# Altium schematic sheet IPG-V1_rev0.24.SchDoc (part 2 of 3)
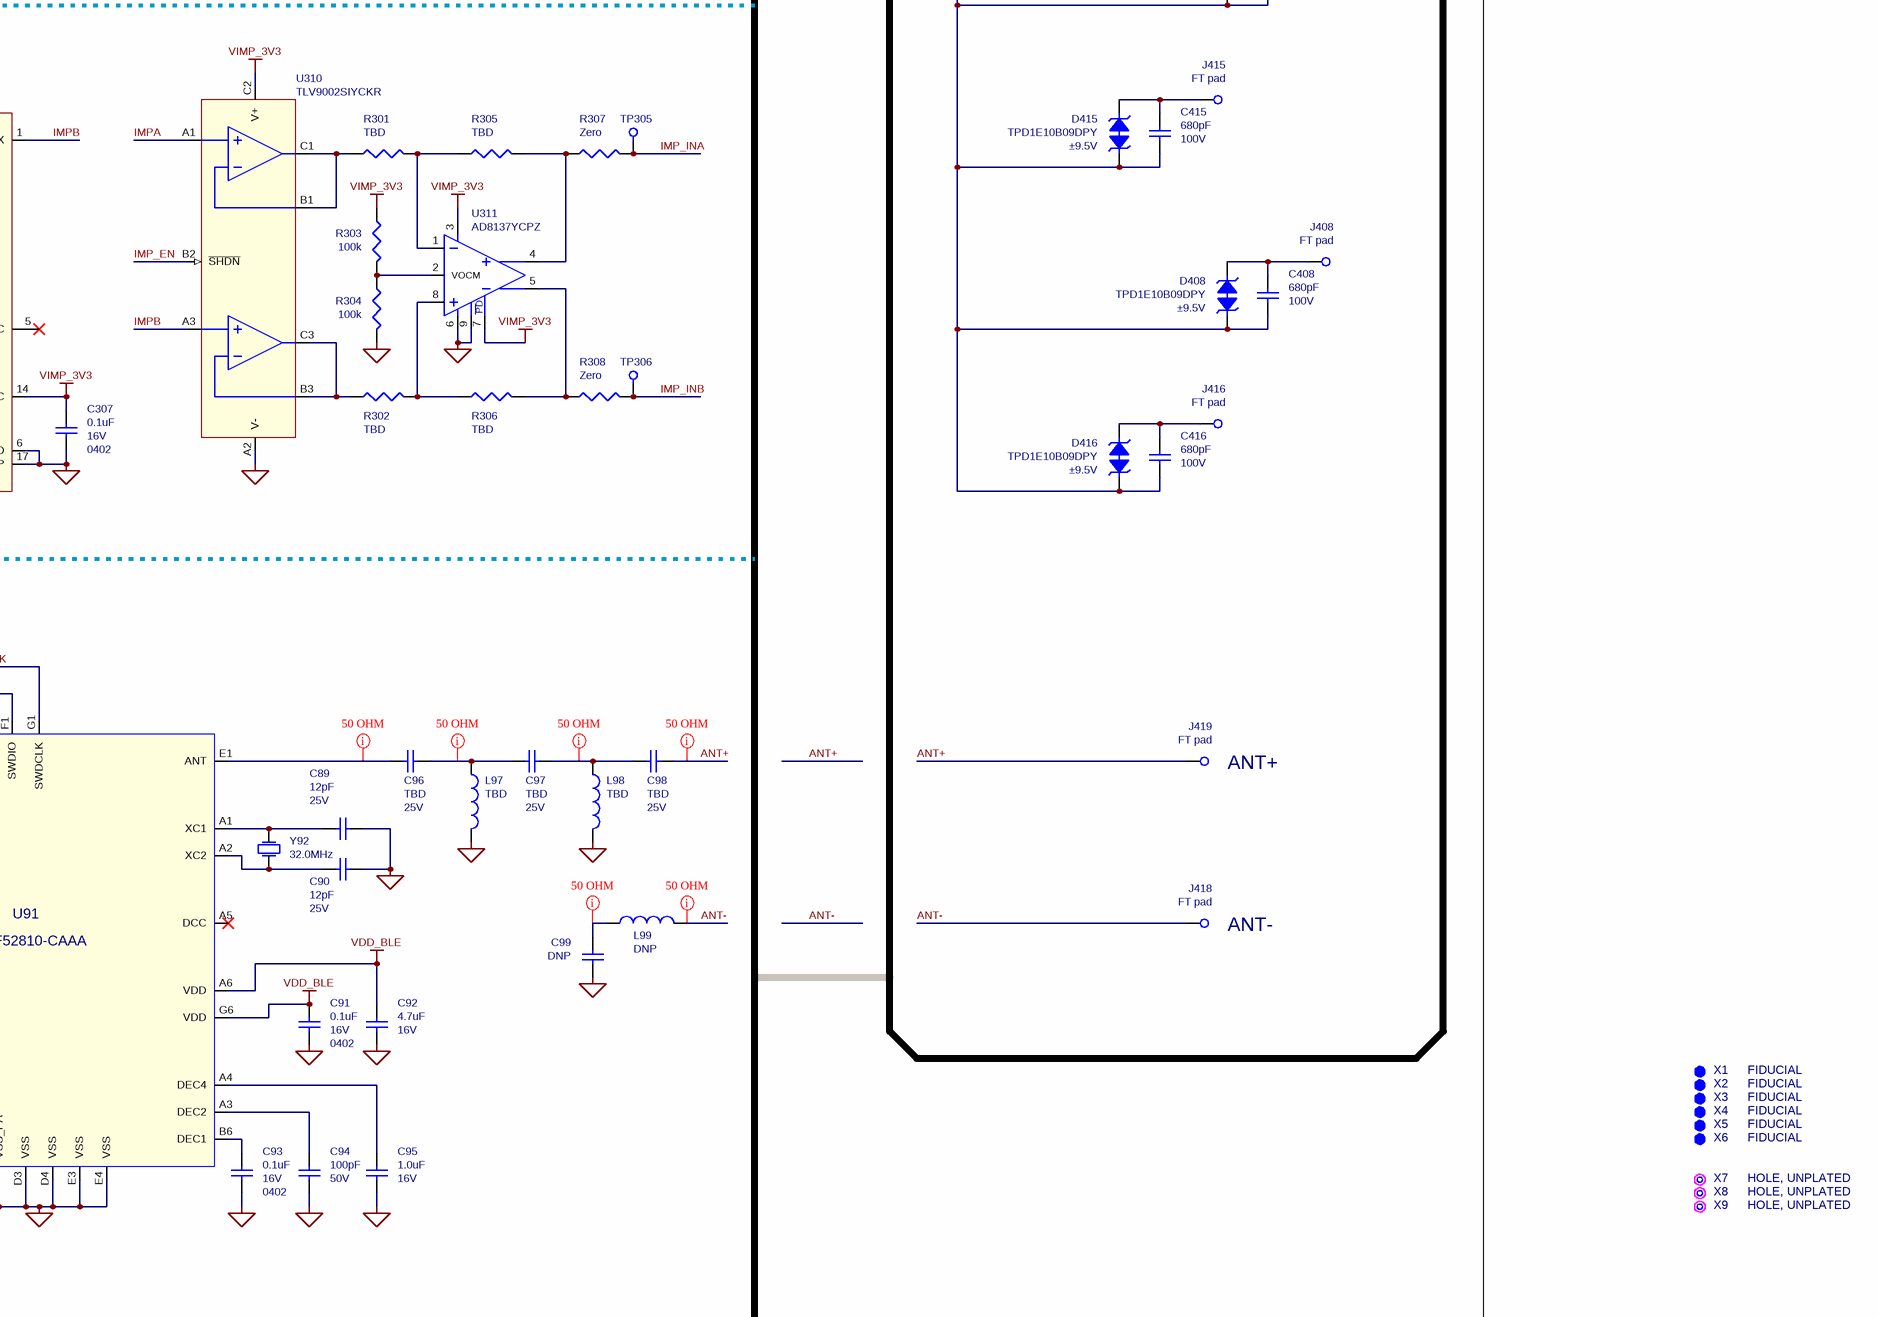
[diagram p9: IPG-V1_rev0.24.SchDoc, bottom right]

## Nets
DVDD: C5.2 C17.2 C26.1 C27.2 C28.2 C29.2 C30.2 C31.2 C32.2 C36.2 C37.1 C38.2 C46.1 J908.1 J909.3 J910.1 L6.1 M27.2(S) M91.2(S) M504.2(S) M507.2(S) R30.1 R47.2 R48.2 R54.1 TP12.1 TP42.1 U1.1(OUT) U17.A12(VDDUSB) U17.D4(VDD) U17.D8(VDDIO2) U17.D9(VDD) U17.F7(VDD) U17.G6(VDD) U17.J4(VDD) U17.J9(VDD) U18.4(VDD)
GND: C3.2 C4.1 C5.1 C6.1 C7.1 C8.1 C9.1 C10.2 C11.1 C12.1 C13.1 C14.1 C15.2 C16.2 C17.1 C18.2 C19.2 C20.2 C21.2 C22.1 C23.1 C24.2 C25.2 C26.2 C27.1 C28.1 C29.1 C30.1 C31.1 C32.1 C33.1 C34.2 C35.1 C36.1 C37.2 C38.1 C39.1 C45.1 C46.2 C87.1 C88.1 C89.2 C90.2 C91.1 C92.2 C93.1 C94.1 C95.2 C99.2 C206.1 C207.1 C246.1 C247.1 C301.1 C303.1 C304.1 C306.1 C307.1 C505.1 C506.1 C508.1 C509.1 C510.1 C511.2 C514.2 D417.1 D418.1 D503.2(A) D506.2(A) D507.2(A) F1.2 F2.2 J905.4 J906.2 J907.1 J908.2 J909.1 J910.3 J910.5 J910.9 J911.3 J911.5 J911.9 L97.2 L98.2 M3.2(S) M4.2(S) M6.2(S) M7.2(S) M8.2(S) M11.2(S) M12.2(S) M14.2(S) M15.2(S) M16.2(S) M19.2(S) M20.2(S) M23.2(S) M25.2(S) M26.2(S) M29.2(S) M31.2(S) M34.2(S) M301.2(S) M302.2(S) M303.2(S) M304.2(S) M317.2(S) M319.2(S) M501.2(S) M502.2(S) M505.2(S) M506.1(D) M509.2(S) M511.2(S) M512.2(S) M513.2(S) M514.2(S) R4.2 R6.2 R11.2 R19.2 R25.2 R28.2 R39.2 R43.2 R46.2 R51.2 R52.2 R55.1 R214.2 R215.2 R254.2 R255.2 R276.2 R278.2 R279.2 R304.2 R371.2 R372.2 R373.2 R374.2 R387.2 R503.2 R505.2 R506.2 R508.2 R512.2 R516.2 R518.2 R521.2 R528.2 R530.2 SW901.1 SW901.2 TP90.1 TP91.1 TP92.1 TP93.1 TP94.1 TP95.1 TP96.1 TP97.1 TP98.1 TP99.1 U1.2(GND) U1.5(EP) U2.1(GND) U2.5(~{EN}) U2.7(EP) U3.B2(V-) U4.1(GND) U4.5(~{EN}) U4.7(EP) U5.B2(V-) U6.B1(V-) U7.B1(V-) U8.4(GND) U9.4(VSS) U10.2(GND) U10.5(EP) U11.2(GND) U11.5(EP) U12.2(GND) U13.3(A0) U13.4(A1) U13.9(GND) U14.B1(V-) U15.B1(V-) U16.B1(V-) U17.E4(VSS) U17.E9(VSS) U17.F6(VSS) U17.G7(VSS) U17.H1(VSSA) U17.H4(VSS) U17.H9(VSS) U17.L10(VCAP_/_VSSSMPS) U18.3(GND) U18.5(EP) U30.3(VSS) U30.4(GND) U30.21(EP) U31.3(VSS) U31.4(GND) U31.21(EP) U91.B3(VSS) U91.B4(VSS) U91.C1(VSS_PA) U91.D3(VSS) U91.D4(VSS) U91.E3(VSS) U91.E4(VSS) U201.A1(GND) U203.A1(GND) U301.3(RSTSEL) U301.4(AGND) U301.5(SPI2C) U303.2(GND) U304.2(GND) U305.A2(V-) U306.1(~{A}) U306.4(GND) U307.4(GND) U308.2(X7) U308.3(X5) U308.6(GND) U308.16(X6) U308.17(EP) U309.2(X7) U309.3(X5) U309.6(GND) U309.16(X6) U309.17(EP) U310.A2(V-) U311.6(VS-) U311.9(EP) U501.B1(V-) U502.2(V-) U503.7(GND) U503.8(GND) U503.10(VS1) U503.11(MODE) U503.12(EXTVCC) U503.18(PGND) U503.19(PGND) U503.21(EP)
HVIN: C15.1 C16.1 L3.1 M28.3(D) M30.3(D) TP33.1 U12.5(VIN)
V_UNREG: C3.1 C4.2 C11.2 C13.2 D3.1(K) D4.1(K) D5.1(K) R5.1 TP10.1 U1.4(IN) U10.4(IN) U11.4(IN)
VBAT1CHG: M9.3(S) R10.1 R12.1 TP14.1 U2.3(BAT)
VBAT1F: C1.2 D6.1(K) L1.2 M1.2(S) M10.3(S) R1.1 R13.1 TP2.1
VBAT1R: C1.1 J1.1 J1.2 J1.3 J1.4 J901.2 L1.1 TP1.1
VBAT1SW: D3.2(A) D11.2(A) M1.3(D) M21.2(S) R23.1 TP7.1
VBAT2CHG: M17.3(S) R18.1 R20.1 TP18.1 U4.3(BAT)
VBAT2F: C2.2 D7.1(K) L2.2 M2.2(S) M18.3(S) R2.1 R21.1 TP5.1
VBAT2R: C2.1 J3.1 J3.2 J3.3 J3.4 J902.2 L2.1 TP4.1
VBAT2SW: D5.2(A) D12.2(A) M2.3(D) M22.2(S) R26.1 TP8.1
VCARR: C503.2 C504.2 C507.1 D501.2(A) D504.2(A) D506.1(K) TP503.1
VCHG_RAIL: C7.2 C9.2 C514.1 D4.2(A) D13.2(A) M5.2(S) M13.2(S) R7.1 R15.1 R529.1 TP512.1 U3.B1(V+) U5.B1(V+) U503.14(VOUT)
VDD_BLE: C91.2 C92.1 J906.1 J907.3 J911.1 M91.3(D) TP81.1 U91.A6(VDD) U91.G6(VDD)
VDDA: C12.2 C206.2 C246.2 R213.1 R253.1 TP28.1 U10.1(OUT) U201.A2(+VS) U201.B3(FR) U203.A2(+VS) U203.B3(FR)
VDDS: C14.2 C301.2 C303.2 C304.2 M318.2(S) R298.1 R299.1 R309.1 TP29.1 U11.1(OUT) U301.1(VDD) U303.5(V+) U304.5(V+) U305.C2(V+) U306.8(VCC) U307.8(VCC)
VGND1R: F1.1 J2.1 J2.2 J2.3 J2.4 J901.4 TP3.1
VGND2R: F2.1 J4.1 J4.2 J4.3 J4.4 J902.4 TP6.1
VIMP_3V3: C306.2 C307.2 M318.3(D) R303.1 TP307.1 U308.14(VCC) U309.14(VCC) U310.C2(V+) U311.3(VS+) U311.7(~{PD})
VPP: M32.3(D) R281.1 R282.1 R283.1 R284.1 R297.1 R311.1 R312.1 R313.1 R314.1 R327.1 R331.1 R332.1 R333.1 R334.1 R347.1 TP35.1 U30.13(VDD) U31.13(VDD)
VRECT: C505.2 C506.2 C510.2 C512.2 D504.1(K) D505.1(K) J905.2 L501.1 M503.3(D) M508.2(S) M515.3(D) R502.1 R504.1 R507.1 R509.1 R511.1 R513.1 R517.1 TP504.1 U503.2(PVIN) U503.3(VIN) U503.4(RUN) U503.20(SW1)
AMPL_CSn: U17.C9(SPI2_NSS_/_PD0) U301.7(~{SYNC}_/_A0)
AMPL_MOSI: U17.B8(SPI2_MOSI_/_USART2_RTS_/_PD4) U301.8(SDIN_/_SDA)
AMPL_RSTn: U17.A9(USART3_RTS_/_UART5_RX_/_PD2) U306.3(~{CLR})
AMPL_SCK: U17.B9(SPI2_SCK_/_PD1) U301.6(SCLK_/_SCL)
ANT+: C98.2 J419.1
ANT-: J418.1 L99.2
BATT1_MON: TP21.1 U6.A1(OUT) U6.C2(IN-) U17.J2(PA0_/_ADC1_IN5_/_UART4_TX_/_WKUP1)
BATT2_MON: TP22.1 U7.A1(OUT) U7.C2(IN-) U17.G4(PA1_/_ADC1_IN6_/_UART4_RX_/_WKUP3_/_SPI1_SCK)
BATT_SW: M3.1(G) M25.3(D) R4.1 R29.2 TP9.1
BATT_SW_EN: D10.2(A) TP23.1 U17.A4(PB9_/_I2C1_SDA_/_SPI2_NSS)
BATTMON_EN: M23.1(G) U6.A2(V+) U7.A2(V+) U17.K2(PA2_/_ADC1_IN7_/_LPUART1_TX_/_WKUP4)
BLE_P03: U17.G10(SPI1_SCK_/_PG2) U91.D6(P0.03_/_AIN1)
BLE_P04: U17.G11(SPI1_MISO_/_PG3) U91.E5(P0.04_/_AIN2)
BLE_P05: U17.G9(SPI1_MOSI_/_PG4) U91.E6(P0.05_/_AIN3)
BLE_P08: U17.G12(LPUART1_CTS_/_SPI1_NSS_/_PG5) U91.F6(P0.08)
BLE_P11: U17.F10(I2C3_SCL_/_LPUART1_TX_/_PG7) U91.F5(P0.11)
BLE_P12: U17.F12(I2C3_SDA_/_LPUART1_RX_/_PG8) U91.G5(P0.12)
BLE_P14: U17.B7(SPI3_SCK_/_USART1_TX_/_PG9) U91.F4(P0.14)
BLE_P15: U17.C7(SPI3_MISO_/_USART1_RX_/_PG10) U91.G4(P0.15)
BLE_P16: U17.M11(VDD11_/_SPI3_MOSI_/_USART1_CTS_/_PG11) U91.G3(P0.16)
BLE_P17: U17.A6(SPI3_NSS_/_USART1_RTS_/_PG12) U91.F3(P0.17)
BLE_PWRn: M91.1(G) U17.K6(ADC4_IN8_/_PG1)
BLE_RSTn: J906.5 J911.10 TP82.1 U17.F9(I2C3_SMBA_/_LPUART1_RTS_/_PG6) U91.F2(P0.21_/_nRESET)
BLE_SWDCLK: J906.4 J911.4 TP83.1 U91.G1(SWDCLK)
BLE_SWDIO: J906.3 J911.2 TP84.1 U91.F1(SWDIO)
BLE_UART_RX: J907.4 TP86.1 U91.E2(P0.18)
BLE_UART_TX: J907.5 TP85.1 U91.G2(P0.20)
CH1: C401.2 D401.2 J401.1 U30.6(D2)
CH2: C402.2 D402.2 J402.1 U30.1(D1)
CH3: C409.2 D409.2 J409.1 U30.15(D4)
CH4: C410.2 D410.2 J410.1 U30.11(D3)
CHG1_EN: M6.1(G) M11.1(G) R14.1 U17.J7(PE10)
CHG1_OVP_ERRn: M12.3(D) R14.2 TP16.1 U17.B2(WKUP1_/_PE4)
CHG1_STATUS: U2.2(~{CHRG}) U17.C2(WKUP3_/_PE6)
CHG2_EN: M14.1(G) M19.1(G) R22.1 U17.L7(PE11)
CHG2_OVP_ERRn: M20.3(D) R22.2 TP20.1 U17.A1(WKUP2_/_PE5)
CHG2_STATUS: U4.2(~{CHRG}) U17.K7(WKUP6_/_PE7)
CHG_RATE1: M7.1(G) M15.1(G) U17.J6(WKUP7_/_PE8)
CHG_RATE2: M8.1(G) M16.1(G) U17.M7(PE9)
DEBUG_CTS: J909.6 TP45.1 U17.C12(PA11_/_USART1_CTS_/_SPI1_MISO)
DEBUG_RTS: J909.2 TP44.1 U17.B12(PA12_/_USART1_RTS_/_SPI1_MOSI)
DEBUG_RX: J909.4 TP46.1 U17.D11(PA10_/_USART1_RX)
DEBUG_TX: J909.5 TP47.1 U17.D10(PA9_/_USART1_TX_/_SPI2_SCK)
ECG1+: R202.1 R203.1 U31.7(S2A) U31.12(S3B)
ECG1-: R201.1 R204.1 U31.14(S4B) U31.20(S1A)
ECG1_LOD: U17.K4(PB2_/_ADC1_IN17_/_WKUP1) U201.C1(LOD)
ECG1_OUT: C203.1 R212.2 U17.M4(PB0_/_ADC1_IN15_/_ADC4_IN18_/_SPI1_NSS) U201.D1(OUT)
ECG1_RLD: U17.B6(PB4_/_NJTRST_/_USART1_CTS_/_SPI1_MISO_/_SPI3_MISO_/_I2C3_SDA) U201.C2(RLD_~{SDN})
ECG1_SDNn: U17.D6(PB5_/_USART1_CK_/_SPI1_MOSI_/_SPI3_MOSI_/_WKUP6) U201.B1(~{SDN})
ECG_SEL1: U17.J8(SPI1_NSS_/_PE12) U31.9(IN3)
ECG_SEL2: U17.M8(SPI1_SCK_/_PE13) U31.17(IN4)
ECG_SEL3: U17.K8(SPI1_MISO_/_PE14) U31.19(IN1)
ECG_SEL4: U17.L8(SPI1_MOSI_/_PE15) U31.8(IN2)
EGG1+: R242.1 R243.1 U31.2(S1B) U31.10(S3A)
EGG1-: R241.1 R244.1 U31.5(S2B) U31.16(S4A)
EGG1_LOD: U17.A5(PB6_/_USART1_TX_/_I2C4_SCL_/_I2C1_SCL_/_WKUP3) U203.C1(LOD)
EGG1_OUT: C243.1 R252.2 U17.L4(PB1_/_ADC1_IN16_/_ADC4_IN19_/_WKUP4) U203.D1(OUT)
EGG1_RLD: U17.D5(PB7_/_USART1_RX_/_I2C4_SDA_/_I2C1_SDA_/_WKUP4) U203.C2(RLD_~{SDN})
EGG1_SDNn: U17.C5(PB8_/_I2C1_SCL_/_WKUP5) U203.B1(~{SDN})
ENCL: C397.2 C401.1 C402.1 C403.1 C404.1 C405.1 C406.1 C407.1 C408.1 C409.1 C410.1 C411.1 C412.1 C413.1 C414.1 C415.1 C416.1 D401.1 D402.1 D403.1 D404.1 D405.1 D406.1 D407.1 D408.1 D409.1 D410.1 D411.1 D412.1 D413.1 D414.1 D415.1 D416.1 D417.2 D418.2 J417.1
FRAM_CSn: U9.1(~{CS}) U17.L3(PA4_/_ADC1_IN9_/_ADC4_IN9_/_SPI1_NSS_/_SPI3_NSS_/_WKUP2)
FRAM_EN: TP27.1 U9.3(~{WP}) U9.8(VDD) U17.D12(PA8_/_USART1_CK)
FRAM_MISO: U9.2(SO) U17.L2(PA6_/_ADC1_IN11_/_ADC4_IN11_/_SPI1_MISO_/_WKUP7)
FRAM_MOSI: U9.5(SI) U17.K3(PA7_/_ADC1_IN12_/_ADC4_IN20_/_SPI1_MOSI_/_I2C3_SCL_/_WKUP8)
FRAM_SCK: U9.6(SCK) U17.M1(PA5_/_ADC1_IN10_/_ADC4_IN10_/_SPI1_SCK_/_WKUP6)
HV_EN: R49.1 R50.1 U12.4(~{SHDN}) U13.8(VCC) U13.10(VLOGIC) U17.L11(PB12_/_SPI2_NSS_/_I2C2_SMBA)
HV_SCL: R49.2 U13.1(SCL) U17.K10(PB13_/_SPI2_SCK_/_I2C2_SCL)
HV_SDA: R50.2 U13.2(SDA) U17.K11(PB14_/_SPI2_MISO_/_I2C2_SDA)
HVSW_EN: M29.1(G) R53.1 TP31.1 U17.L9(PB11_/_LPUART1_TX_/_I2C4_SDA_/_I2C2_SDA)
IMP1: R351.2 R371.1 U308.11(X0) U309.11(X0)
IMP2: R352.2 R372.1 U308.12(X1) U309.12(X1)
IMP3: R353.2 R373.1 U308.13(X2) U309.13(X2)
IMP4: R354.2 R374.1 U308.10(X3) U309.10(X3)
IMP17: R367.2 R387.1 U308.15(X4) U309.15(X4)
IMP_EN: M319.1(G) U17.E1(WKUP8_/_I2C2_SMBA_/_PF2) U308.4(~{ENABLE}) U309.4(~{ENABLE}) U310.B2(~{SHDN})
IMP_INA: R307.2 TP305.1 U17.J5(ADC4_IN5_/_PF14)
IMP_INB: R308.2 TP306.1 U17.L6(ADC4_IN6_/_PF15)
IMPA: U308.1(X) U310.A1(IN1+)
IMPA_SEL0: U17.D3(PF3) U308.9(A)
IMPA_SEL1: U17.E3(PF4) U308.8(B)
IMPA_SEL2: U17.F2(PF5) U308.7(C)
IMPB: U309.1(X) U310.A3(IN2+)
IMPB_SEL0: U17.K5(PF11) U309.9(A)
IMPB_SEL1: U17.L5(PF12) U309.8(B)
IMPB_SEL2: U17.M5(PF13) U309.7(C)
IPG_SHDN: M4.1(G) R6.1 TP11.1 U17.K9(PB10_/_LPUART1_RX_/_SPI2_SCK_/_I2C4_SCL_/_I2C2_SCL_/_WKUP8)
IREF: Q318.3(C) Q321.2(E) Q322.2(E) Q323.2(E) Q324.2(E) Q337.2(E)
MAG_DET: M27.3(D) TP26.1 U17.L1(PA3_/_ADC1_IN8_/_LPUART1_RX_/_WKUP5)
MAG_EN: R31.1 U17.A11(PA15_/_JTDI_/_SPI1_NSS_/_SPI3_NSS)
MAG_OUTn: M24.1(G) M26.1(G) M27.1(G) R32.2 TP25.1 U8.3(OUT)
MAG_PWR: R30.2 R31.2 R32.1 R33.1 TP24.1 U8.2(VDD)
MUX_ENn: U17.E10(PC7) U30.18(~{EN}) U31.18(~{EN})
NFC_EN: D502.1(K) M511.1(G) R525.1 R526.1 TP509.1 U17.E12(PC8) U502.5(V+)
NFC_RXD: M513.3(D) R524.2 R525.2 TP510.1 U17.A10(PC11_/_UART4_RX_/_USART3_RX_/_SPI3_MISO)
NFC_TXD: D502.2(A) D503.1(K) M501.1(G) M514.1(G) R527.1 TP511.1 U17.B11(PC10_/_UART4_TX_/_USART3_TX_/_SPI3_SCK)
PG_START: U17.A2(PE3) U306.2(B)
PH1_EN: U17.C8(SPI2_MISO_/_SPI2_SCK_/_USART2_CTS_/_PD3) U307.1(1A)
PH1_OUT: TP303.1 U303.6(IN) U307.7(1Y)
PH2_EN: U17.A8(USART2_TX_/_PD5) U307.6(2B)
PH2_OUT: TP304.1 U304.6(IN) U307.3(2Y)
REC1: U30.5(S2B) U31.11(D3)
REC2: U30.2(S1B) U31.15(D4)
REC3: U30.14(S4B) U31.1(D1)
REC4: U30.12(S3B) U31.6(D2)
SNK1: M301.1(G) U17.D7(USART2_CK_/_PD7)
SNK2: M302.1(G) U17.J10(USART3_RX_/_PD9)
SNK3: M303.1(G) U17.J11(I2C4_SMBA_/_USART3_CTS_/_ADC4_IN15_/_PD11)
SNK4: M304.1(G) U17.H11(I2C4_SDA_/_ADC4_IN17_/_PD13)
SNK17: M317.1(G) U17.H12(PD15)
SR_SEL1: U17.D2(I2C2_SDA_/_PF0) U30.8(IN2) U30.19(IN1)
SR_SEL2: U17.E2(I2C2_SCL_/_PF1) U30.9(IN3) U30.17(IN4)
SRC1: Q321.1(B) U17.A7(SPI3_MOSI_/_USART2_RX_/_PD6)
SRC2: Q322.1(B) U17.L12(USART3_TX_/_PD8)
SRC3: Q323.1(B) U17.M12(USART3_CK_/_PD10)
SRC4: Q324.1(B) U17.J12(I2C4_SCL_/_USART3_RTS_/_ADC4_IN16_/_PD12)
SRC17: Q337.1(B) U17.H10(PD14)
STIM1: C381.2 U30.7(S2A)
STIM2: C382.2 U30.20(S1A)
STIM3: C383.2 U30.16(S4A)
STIM4: C384.2 U30.10(S3A)
STIM_EN: U17.B3(PE2) U305.B2(~{SHDN})
SWCLK: J908.4 J910.4 TP40.1 U17.C11(PA14_/_JTCK_/_SWCLK)
SWDIO: J908.3 J910.2 TP41.1 U17.C10(PA13_/_JTMS_/_SWDIO)
SWO: J908.6 J910.6 TP48.1 U17.C6(PB3_/_SWO_/_JTDO_/_USART1_RTS_/_SPI1_SCK_/_SPI3_SCK_/_I2C1_SDA)
SYS_RSTn: J908.5 J910.10 R54.2 TP43.1 U17.G2(NRST) U18.1(~{RESET})
TEMP_EN: R42.1 R44.1 TP36.1 U14.A2(V+) U15.A2(V+) U16.A2(V+) U17.F11(PC6)
TEST_TRIG: TP49.1 U17.M6(ADC4_IN7_/_PG0)
THERM_OFST: TP39.1 U16.A1(OUT) U16.C2(IN-) U17.H2(PC0_/_ADC1_IN1_/_ADC4_IN1_/_LPUART1_RX_/_I2C3_SCL)
THERM_OUT: TP38.1 U15.A1(OUT) U15.C2(IN-) U17.G3(PC1_/_ADC1_IN2_/_ADC4_IN2_/_SPI2_MOSI_/_LPUART1_TX_/_I2C3_SDA)
THERM_REF: TP37.1 U14.A1(OUT) U14.C2(IN-) U17.F3(PC2_/_ADC1_IN3_/_ADC4_IN3_/_SPI2_MISO)
TX_BLANK: M512.1(G) U17.E11(PC9)
VCHG_PGOOD: U17.B10(PC12_/_UART5_TX_/_USART3_CK_/_SPI3_MOSI) U503.13(PGOOD)
VDDA_EN: U10.3(EN) U17.A3(PE1)
VDDS_EN: U11.3(EN) U17.C4(PE0)
VPPSW_EN: M34.1(G) U17.K12(PB15_/_SPI2_MOSI_/_WKUP7)
VRECT_DET: M504.3(D) R506.1 TP505.1 U17.C3(PC13_/_WKUP2)
VRECT_MON: TP508.1 U17.F4(PC3_/_ADC1_IN4_/_ADC4_IN4_/_SPI2_MOSI) U501.A1(OUT) U501.C2(IN-)
VRECT_MON_EN: M509.1(G) TP507.1 U17.M3(PC4_/_ADC1_IN13_/_ADC4_IN22) U501.A2(V+)
VRECT_OVP: M507.3(D) R512.1 TP506.1 U17.J3(PC5_/_ADC1_IN14_/_ADC4_IN23_/_WKUP5)
NetC6_2: C6.2 R10.2 R11.1 U3.A2(IN)
NetC8_2: C8.2 R18.2 R19.1 U5.A2(IN)
NetC10_1: C10.1 M24.3(D) M25.1(G) R34.1
NetC18_1: C18.1 M5.3(D) TP13.1 U2.4(VCC)
NetC19_1: C19.1 M13.3(D) TP17.1 U4.4(VCC)
NetC20_1: C20.1 C21.1 D14.1(K) M32.2(S) R38.1 R40.1 TP34.1
NetC22_2: C22.2 U17.D1(PC15_/_OSC32_OUT) Y1.2
NetC23_2: C23.2 U17.C1(PC14_/_OSC32_IN) Y1.1
NetC24_1: C24.1 U17.G1(OSC_OUT_/_PH1) Y2.2
NetC25_1: C25.1 U17.F1(OSC_IN_/_PH0) Y2.1
NetC33_2: C33.2 U17.J1(VREF+)
NetC34_1: C34.1 C35.2 L6.2 U17.K1(VDDA)
NetC39_2: C39.2 M31.1(G) R53.2 TP32.1
NetC45_2: C45.2 L5.1 U17.B4(VDD11_/_PG15)
NetC87_2: C87.2 U91.D5(P0.01_/_XL2) Y91.2
NetC88_2: C88.2 U91.B5(P0.00_/_XL1) Y91.1
NetC89_1: C89.1 U91.A1(XC1) Y92.2
NetC90_1: C90.1 U91.A2(XC2) Y92.1
NetC93_2: C93.2 U91.B6(DEC1)
NetC94_2: C94.2 U91.A3(DEC2)
NetC95_1: C95.1 U91.A4(DEC4)
NetC96_1: C96.1 U91.E1(ANT)
NetC96_2: C96.2 C97.1 L97.1
NetC97_2: C97.2 C98.1 L98.1
NetC99_1: C99.1 L99.1
NetC201_1: C201.1 R205.2 U201.D5(RLD)
NetC201_2: C201.2 U201.C4(RLDFB)
NetC202_1: C202.1 U201.A5(HPDRIVE)
NetC202_2: C202.2 R208.2 U201.A4(HPSENSE)
NetC203_2: C203.2 R209.2 R210.1
NetC204_1: C204.1 R210.2 U201.D3(OPAMP+)
NetC204_2: C204.2 C205.1 R211.1 U201.C3(REFOUT)
NetC205_2: C205.2 R206.1 U201.D4(SW)
NetC207_2: C207.2 R213.2 R214.1 U201.A3(REFIN)
NetC241_1: C241.1 R245.2 U203.D5(RLD)
NetC241_2: C241.2 U203.C4(RLDFB)
NetC242_1: C242.1 R248.2 U203.A4(HPSENSE)
NetC242_2: C242.2 U203.A5(HPDRIVE)
NetC243_2: C243.2 R249.2 R250.1
NetC244_1: C244.1 R250.2 U203.D3(OPAMP+)
NetC244_2: C244.2 C245.2 R251.1 U203.C3(REFOUT)
NetC245_1: C245.1 R246.1 U203.D4(SW)
NetC247_2: C247.2 R253.2 R254.1 U203.A3(REFIN)
NetC305_1: C305.1 U306.6(CEXT)
NetC305_2: C305.2 R298.2 U306.7(REXT_/_CEXT)
NetC381_1: C381.1 M301.3(D) Q301.6(C2) R351.1
NetC382_1: C382.1 M302.3(D) Q302.6(C2) R352.1
NetC383_1: C383.1 M303.3(D) Q303.6(C2) R353.1
NetC384_1: C384.1 M304.3(D) Q304.6(C2) R354.1
NetC397_1: C397.1 M317.3(D) Q317.6(C2) R367.1
NetC403_2: C403.2 D403.2 J403.1
NetC404_2: C404.2 D404.2 J404.1
NetC405_2: C405.2 D405.2 J405.1
NetC406_2: C406.2 D406.2 J406.1
NetC407_2: C407.2 D407.2 J407.1
NetC408_2: C408.2 D408.2 J408.1
NetC411_2: C411.2 D411.2 J411.1
NetC412_2: C412.2 D412.2 J412.1
NetC413_2: C413.2 D413.2 J413.1
NetC414_2: C414.2 D414.2 J414.1
NetC415_2: C415.2 D415.2 J415.1
NetC416_2: C416.2 D416.2 J416.1
NetC501_1: C501.1 C502.1 C503.1 C504.1 J501.1 TP501.1
NetC501_2: C501.2 C502.2 D505.2(A) D507.1(K) J502.1 TP502.1
NetC507_2: C507.2 D508.2(A) R517.2 R518.1
NetC508_2: C508.2 D508.1(K) M510.2(S) R519.1
NetC509_2: C509.2 R520.2 R521.1 R523.1 U502.1(IN+)
NetC511_1: C511.1 R531.1 U503.5(VCC) U503.6(MPPC)
NetC512_1: C512.1 U503.1(BST1)
NetC513_1: C513.1 U503.16(BST2)
NetC513_2: C513.2 L501.2 U503.15(SW2)
NetD1_1: D1.1(K) D2.1(K) R3.1
NetD1_2: D1.2(A) M1.1(G) R1.2
NetD2_2: D2.2(A) M2.1(G) R2.2
NetD6_2: D6.2(A) M9.1(D) M10.1(D)
NetD7_2: D7.2(A) M17.1(D) M18.1(D)
NetD8_1: D8.1(K) D9.1(K) M23.3(D)
NetD8_2: D8.2(A) M21.1(G) R23.2
NetD9_2: D9.2(A) M22.1(G) R26.2
NetD10_1: D10.1(K) R29.1
NetD11_1: D11.1(K) D12.1(K) D13.1(K) M30.2(S) R35.1 R36.1 R37.1 TP30.1
NetD14_2: D14.2(A) L3.2 U12.1(SW)
NetD501_1: D501.1(K) R501.1
NetJ5_1: J5.1 R45.2 U15.C1(IN+)
NetJ6_1: J6.1 R46.1 U16.C1(IN+)
NetL5_2: L5.2 U17.M10(I2C1_SDA_/_VLXSMPS_/_PG13)
NetM3_3: M3.3(D) R3.2
NetM4_3: M4.3(D) R5.2 U1.3(EN)
NetM5_1: M5.1(G) M6.3(D) R7.2
NetM7_3: M7.3(D) R8.2
NetM8_3: M8.3(D) R9.2
NetM9_2: M9.2(G) M12.1(G) R12.2 TP15.1 U3.A1(OUT)
NetM10_2: M10.2(G) M11.3(D) R13.2
NetM13_1: M13.1(G) M14.3(D) R15.2
NetM15_3: M15.3(D) R16.2
NetM16_3: M16.3(D) R17.2
NetM17_2: M17.2(G) M20.1(G) R20.2 TP19.1 U5.A1(OUT)
NetM18_2: M18.2(G) M19.3(D) R21.2
NetM21_3: M21.3(D) R24.1
NetM22_3: M22.3(D) R27.1
NetM24_2: M24.2(S) R33.2
NetM26_3: M26.3(D) R34.2
NetM28_1: M28.1(G) M29.3(D) R36.2
NetM28_2: M28.2(S) R35.2
NetM30_1: M30.1(G) M31.3(D) R37.2
NetM32_1: M32.1(G) R40.2 R41.1
NetM33_1: M33.1(G) R42.2 R43.1
NetM33_2: M33.2(S) R44.2
NetM33_3: M33.3(D) R45.1 U14.C1(IN+)
NetM34_3: M34.3(D) R41.2
NetM318_1: M318.1(G) M319.3(D) R309.2
NetM501_3: M501.3(D) R501.2
NetM502_1: M502.1(G) R502.2 R503.1
NetM502_3: M502.3(D) M503.1(G) M504.1(G) R504.2
NetM503_2: M503.2(S) R505.1
NetM505_1: M505.1(G) R507.2 R508.1
NetM505_3: M505.3(D) M507.1(G) R510.2
NetM506_2: M506.2(G) R509.2 R510.1
NetM506_3: M506.3(S) R511.2
NetM508_1: M508.1(G) R513.2 R514.1
NetM508_3: M508.3(D) R515.1
NetM509_3: M509.3(D) R514.2
NetM510_1: M510.1(G) M511.3(D) R519.2
NetM510_3: M510.3(D) R520.1 R522.1 U502.3(IN-)
NetM512_3: M512.3(D) R522.2
NetM513_1: M513.1(G) R523.2 R524.1 U502.4(OUT)
NetM514_3: M514.3(D) M515.1(G) R526.2 R527.2
NetM515_2: M515.2(S) R528.1
NetQ301_1: Q301.1(E2) R331.2
NetQ301_2: Q301.2(B2) Q301.3(C1) Q301.5(B1) Q321.3(C) R281.2
NetQ301_4: Q301.4(E1) R311.2
NetQ302_1: Q302.1(E2) R332.2
NetQ302_2: Q302.2(B2) Q302.3(C1) Q302.5(B1) Q322.3(C) R282.2
NetQ302_4: Q302.4(E1) R312.2
NetQ303_1: Q303.1(E2) R333.2
NetQ303_2: Q303.2(B2) Q303.3(C1) Q303.5(B1) Q323.3(C) R283.2
NetQ303_4: Q303.4(E1) R313.2
NetQ304_1: Q304.1(E2) R334.2
NetQ304_2: Q304.2(B2) Q304.3(C1) Q304.5(B1) Q324.3(C) R284.2
NetQ304_4: Q304.4(E1) R314.2
NetQ317_1: Q317.1(E2) R347.2
NetQ317_2: Q317.2(B2) Q317.3(C1) Q317.5(B1) Q337.3(C) R297.2
NetQ317_4: Q317.4(E1) R327.2
NetQ318_1: Q318.1(B) R277.2
NetQ318_2: Q318.2(E) R278.1 U305.B1(IN1-)
NetR8_1: R8.1 R9.1 R51.1 U2.6(PROG)
NetR16_1: R16.1 R17.1 R52.1 U4.6(PROG)
NetR24_2: R24.2 R25.1 U6.C1(IN+)
NetR27_2: R27.2 R28.1 U7.C1(IN+)
NetR38_2: R38.2 U12.3(FB) U13.6(RW)
NetR39_1: R39.1 U13.7(RH)
NetR47_1: R47.1 U17.B1(VBAT)
NetR48_1: R48.1 U17.M9(I2C1_SCL_/_VDDSMPS_/_PG14)
NetR55_2: R55.2 U17.B5(BOOT0_/_PH3)
NetR201_2: R201.2 R202.2 R205.1
NetR203_2: R203.2 U201.B5(+IN)
NetR204_2: R204.2 U201.C5(-IN)
NetR206_2: R206.2 R207.2 R208.1
NetR207_1: R207.1 R209.1 U201.B4(IAOUT)
NetR211_2: R211.2 R212.1 U201.D2(OPAMP-)
NetR215_1: R215.1 U201.B2(AC_/_~{DC})
NetR241_2: R241.2 R242.2 R245.1
NetR243_2: R243.2 U203.B5(+IN)
NetR244_2: R244.2 U203.C5(-IN)
NetR246_2: R246.2 R247.2 R248.1
NetR247_1: R247.1 R249.1 U203.B4(IAOUT)
NetR251_2: R251.2 R252.1 U203.D2(OPAMP-)
NetR255_1: R255.1 U203.B2(AC_/_~{DC})
NetR276_1: R276.1 U303.4(COM) U304.4(COM) U305.A1(IN1+)
NetR277_1: R277.1 U305.C1(OUT1)
NetR279_1: R279.1 U305.A3(IN2+) U305.B3(IN2-)
NetR299_2: R299.2 R300.2 U307.2(1B) U307.5(2A)
NetR300_1: R300.1 U306.5(Q)
NetR301_1: R301.1 U310.B1(IN1-) U310.C1(OUT1)
NetR301_2: R301.2 R305.1 U311.1(-IN)
NetR302_1: R302.1 U310.B3(IN2-) U310.C3(OUT2)
NetR302_2: R302.2 R306.1 U311.8(+IN)
NetR303_2: R303.2 R304.1 U311.2(VOCM)
NetR305_2: R305.2 R307.1 U311.4(+OUT)
NetR306_2: R306.2 R308.1 U311.5(-OUT)
NetR515_2: R515.2 R516.1 U501.C1(IN+)
NetR529_2: R529.2 R530.1 R531.2 U503.9(VS2)
NetSW901_3: SW901.3 SW901.4 U18.2(~{MR})
NetTP301_1: TP301.1 U301.10(VREFIO)
NetU301_2: U301.2(VOUTA) U303.1(NO)
NetU301_9: U301.9(VOUTB) U304.1(NO)

Not connected (* = marked no-connect by the designer): J901 1* 3*; J902 1* 3*; J905 1* 3*; J906 6*; J907 2* 6*; J910 7* 8*; J911 6* 7* 8*; U6 B2(NC)*; U7 B2(NC)*; U8 1(NC)*; U9 7(DNU)*; U13 5(RL)*; U14 B2(NC)*; U15 B2(NC)*; U16 B2(NC)*; U17 H3(OPAMP1_VINM)* M2(OPAMP2_VINM)*; U91 A5(DCC)*; U303 3(NC)*; U304 3(NC)*; U305 C3(OUT2)*; U308 5(NC)*; U309 5(NC)*; U501 B2(NC)*; U503 17(NC)*

## Layout directives
net class 50_OHM; rule Impedance Constraint [Min = 50.00    Max = 50.00    ]: ANT+, ANT-, NetC96_1, NetC96_2, NetC97_2, NetC99_1

## Notes on the sheet
- Coil Tuning
- (near TP503) LSK Data Out
- Rectifier
- Dummy Load
- VRECT Over-Voltage Protect
- VRECT Monitor
- Near-Field Communications
- VCHG_RAIL Supply
- Coil
  Connections
- (near J905) Test Ring VRECT
  Connector
- Battery Interface
- Batt Connect Switches
- DVDD Supply
- Charge Controller 1
- Battery 1 Over-Voltage Protection
- Sense Channels
- Stim Outputs
- (near J417) ENCL
- DVDD = 3.3V
- IPG Battery #1
  Connections
- (near J401) CH1
- (near J901) IPG Battery 1
  Connector
- CHG_RATE1
- CHG_RATE2
- (near R51) Charge
  Current
- (near J409) CH3
- High
- Low
- 100 mA
- 70 mA
- 50 mA
- IPG Battery Monitor
- 20 mA
- IPG Battery #2
  Connections
- Charge Controller 2
- Battery 2 Over-Voltage Protection
- (near J402) CH2
- (near J410) CH4
- (near J902) IPG Battery 2
  Connector
- Magnet Sensor
- (near R52) Charge
  Current
- 10 mA
- 25 mA
- Reset Monitor
- HV Input Switch
- HV Supply
- Reset Threshold = 2.63V
- Microcontroller
- (near J910) STM Programming Interface
- (near J909) Serial Debug Interface
- (near SW901) Reset Button
- Stim Amplitude Control
- Pulse Guard
- Serial FRAM
- VDDS Supply
- Impedance Measurement
- VDDS = 3.3V
- VDDA Supply
- VDDA = 3.3V
- Thermistor Interface
- BLE Transceiver
- (near J419) ANT+
- (near J911) BLE Programming Interface
- (near J418) ANT-
- (near J5) Thermistor
  Connections
- (near J907) BLE Serial Debug Port
- Title:
- Size:
- Modified:
- E
- Doc #:
- Revision:
- Sheet:
- of
- (in symbol AD8137) PD
- (in symbol TLV4021R1YKAR) 1.20V